# Altium schematic sheet Sheet1.SchDoc
size A4
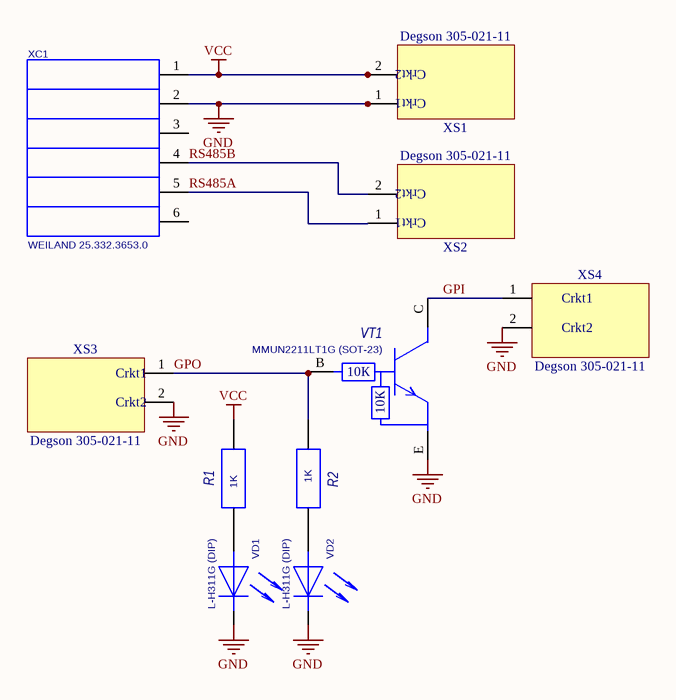
[diagram p0: Sheet1.SchDoc]

## Parts
R1  value 1K  [RESC0603N]  (hidden comment: R0603)
R2  value 1K  [RESC0603N]  (hidden comment: R0603)
VD1  L-H311G (DIP)  [L-H311]
VD2  L-H311G (DIP)  [L-H311]
VT1  MMUN2211LT1G (SOT-23)  parR1value: 10К  [SOT95P230-3N (SOT-23)]
XC1  WEILAND 25.332.3653.0  [WEILAND_25.332.3653.0]
XS1  Degson 305-021-11  [305-021-11]
XS2  Degson 305-021-11  [305-021-11]
XS3  Degson 305-021-11  [305-021-11]
XS4  Degson 305-021-11  [305-021-11]

## Nets
GND: VD1.2(cathode) VD2.2(cathode) VT1.E XC1.2 XS1.1 XS3.2 XS4.2
VCC: R1.2 XC1.1 XS1.2
GPI: VT1.C XS4.1
GPO: R2.1 VT1.B XS3.1
RS485A: XC1.5 XS2.1
RS485B: XC1.4 XS2.2
NetR1_1: R1.1 VD1.1(anod)
NetR2_2: R2.2 VD2.1(anod)

Not connected (* = marked no-connect by the designer): XC1 3 6

## Notes on the sheet
- (in symbol 305-021-11) Crkt2; Crkt1

## Library data of the parts
R1 R2 = R0603: SType: -0.125 ВТ-; Note: {Note}; Title: Резистор; Addit: -5%-; MFG: ф.Bourns; ComponentAttribute: ±5%; Type1: чип тип 0603
VD1 VD2 = L-H311G: cmpManufacturer: PARALight; parFCurrent: 30мА; parPwr: 78мВт; parVoltage: 5В; cmpType: LED; cmpMaterial: GaP/GaP; parColor: Green; parLvTyp: 20мКд; cmpDescription: L-H311G, LED Green, 30мА 20мКд, 5В, DIP; Category: Диод; cmpPkg: DIP; cmpPartNum: L-H311G
VT1 = MUN2211T1: cmpManufacturer: On Semiconductor; Title: Транзистор; parHfe: 35-60; parOTemp: -55°C to 150°C; parCurrent: 0.1А; parVce: 50В; cmpType: NPN General; cmpDescription: MMUN2211LT1G, NPN General, 50В, 0.1А, hfe=35-60, SOT-23; Category: Транзистор; cmpPkg: SOT-23; cmpPartNum: MMUN2211LT1G; parR2value: 10К
XC1 = WEILAND_6PIN_5MM: cmpCategory: Industrial; cmpDescription: pitch, pins,; Value: *; Category: Разъем; cmpPartNum: WEILAND 25.332.3653.0
XS1-XS4 = 305-021-11: Клеммник винтовой, 2-контактный, 5мм, прямой; parType: Straight; cmpCategory: Industrial; cmpDescription: Degson Клеммник винтовой 5mm pitch,2 pins, Straight; cmpPinCount: 2; cmpPitch: 5mm; Category: Разъем; cmpPartNum: 305-021-11; cmpManufacturer: Degson; cmpType: Клеммник винтовой